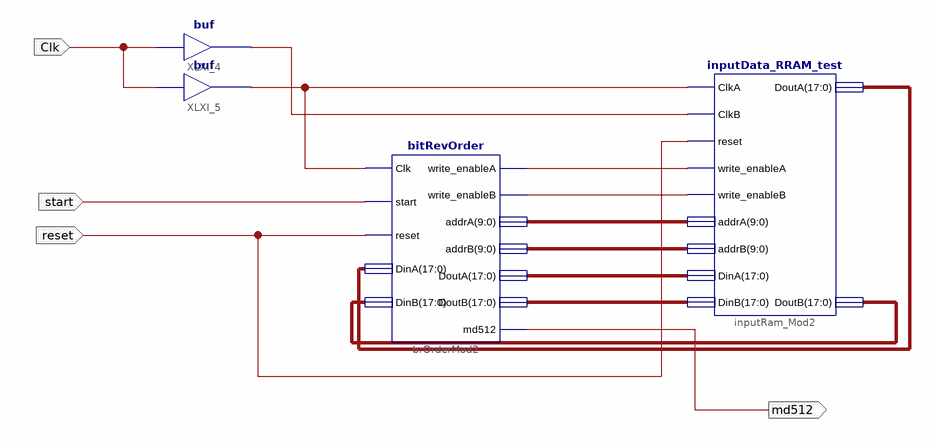
[diagram p0: schematic sheet 1]
// Xilinx ISE schematic bitrevorder_test_top2.sch (spartan6) as structural Verilog: 4 symbols, 4 ports
module bitrevorder_test_top2 (
  input  Clk,
  input  start,
  input  reset,
  output md512
);

  wire XLXN_1, XLXN_2, XLXN_11, XLXN_12;
  wire [9:0] XLXN_3, XLXN_4;
  wire [17:0] XLXN_5, XLXN_6, XLXN_7, XLXN_8;

  bitRevOrder brOrderMod2 (
    .Clk(XLXN_11), .start(start), .reset(reset), .DinA(XLXN_8), .DinB(XLXN_7), .write_enableA(XLXN_1),
    .write_enableB(XLXN_2), .addrA(XLXN_3), .addrB(XLXN_4), .DoutA(XLXN_5), .DoutB(XLXN_6), .md512(md512));
  inputData_RRAM_test inputRam_Mod2 (
    .ClkA(XLXN_11), .ClkB(XLXN_12), .reset(reset), .write_enableA(XLXN_1), .write_enableB(XLXN_2),
    .addrA(XLXN_3), .addrB(XLXN_4), .DinA(XLXN_5), .DinB(XLXN_6), .DoutA(XLXN_8), .DoutB(XLXN_7));
  buf XLXI_4 (XLXN_12, Clk);
  buf XLXI_5 (XLXN_11, Clk);
endmodule
